# EAGLE design Ex Controller 1 USB Device (EAGLE 7.6.0)
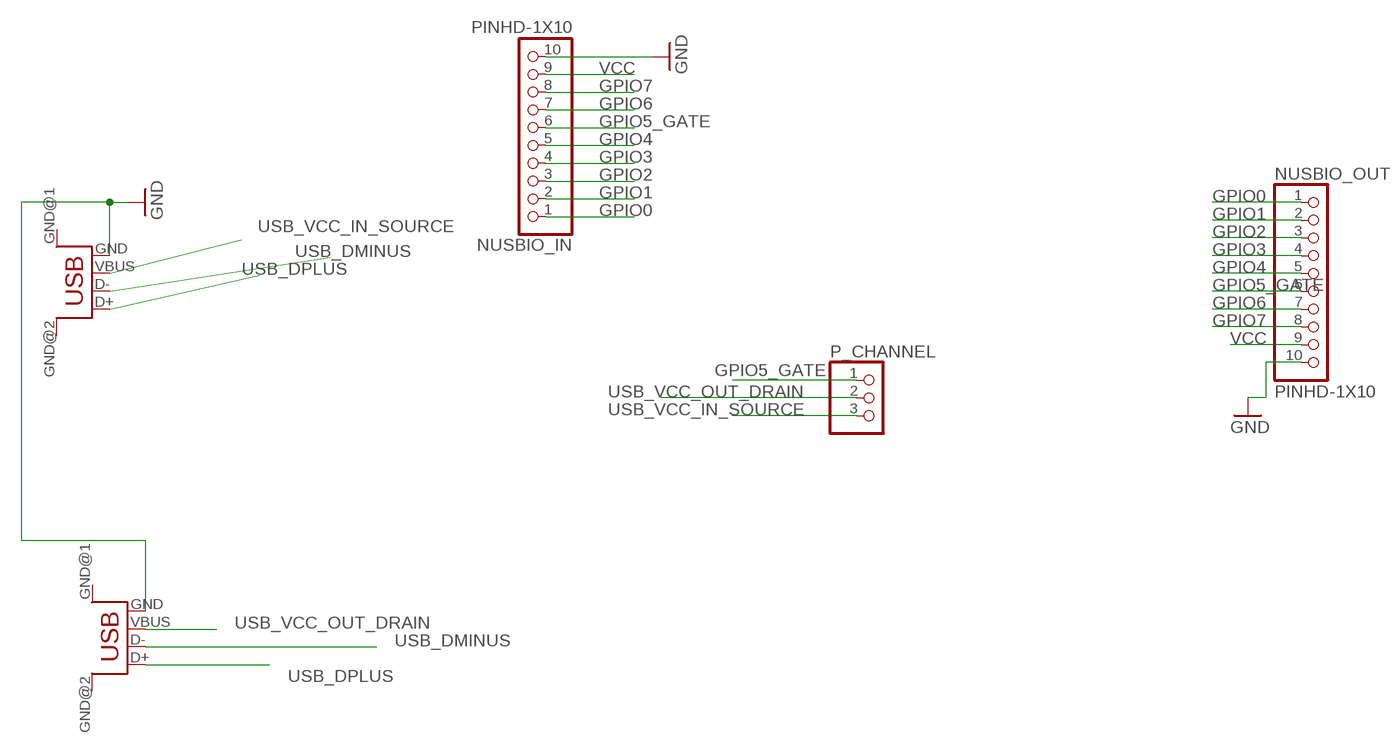
[diagram p0: schematic, sheet 1]

## Parts
NUSBIO_IN  PINHD-1X10  [1X10-BIG]
NUSBIO_OUT  PINHD-1X10  [1X10-BIG]
P_CHANNEL  PINHD-1X3  [1X03]
USB_DEV_INPUT  USB  [USB-FEMALE-A-PTH]
USB_DEV_OUTPUT  USB  [USB-FEMALE-A-PTH]

## Nets
GND: NUSBIO_IN.10 NUSBIO_OUT.10 USB_DEV_INPUT.GND USB_DEV_OUTPUT.GND
GPIO0: NUSBIO_IN.1 NUSBIO_OUT.1
GPIO1: NUSBIO_IN.2 NUSBIO_OUT.2
GPIO2: NUSBIO_IN.3 NUSBIO_OUT.3
GPIO3: NUSBIO_IN.4 NUSBIO_OUT.4
GPIO4: NUSBIO_IN.5 NUSBIO_OUT.5
GPIO5_GATE: NUSBIO_IN.6 NUSBIO_OUT.6 P_CHANNEL.1
GPIO6: NUSBIO_IN.7 NUSBIO_OUT.7
GPIO7: NUSBIO_IN.8 NUSBIO_OUT.8
USB_DMINUS: USB_DEV_INPUT.D- USB_DEV_OUTPUT.D-
USB_DPLUS: USB_DEV_INPUT.D+ USB_DEV_OUTPUT.D+
USB_VCC_IN_SOURCE: P_CHANNEL.3 USB_DEV_INPUT.VBUS
USB_VCC_OUT_DRAIN: P_CHANNEL.2 USB_DEV_OUTPUT.VBUS
VCC: NUSBIO_IN.9 NUSBIO_OUT.9
Unconnected: USB_DEV_INPUT.GND@1(GND) USB_DEV_INPUT.GND@2(GND) USB_DEV_OUTPUT.GND@1(GND) USB_DEV_OUTPUT.GND@2(GND)

## Library data of the parts
NUSBIO_IN NUSBIO_OUT = adafruit:PINHD-1X10: Pin header 1x10 0.1" spacing With round pins
P_CHANNEL = adafruit:PINHD-1X3: PIN HEADER
USB_DEV_INPUT USB_DEV_OUTPUT = STUNTAZ:USB: USB Connectors USB-FEMALE-A-PTH: Through hole Female Type A Connector

## Board
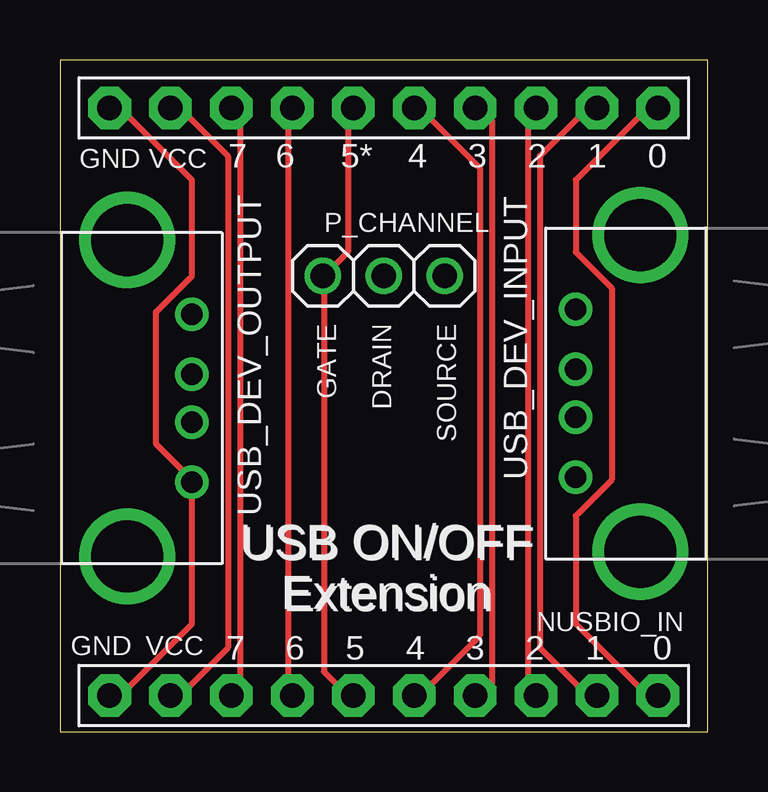
[diagram p1: board, top side]
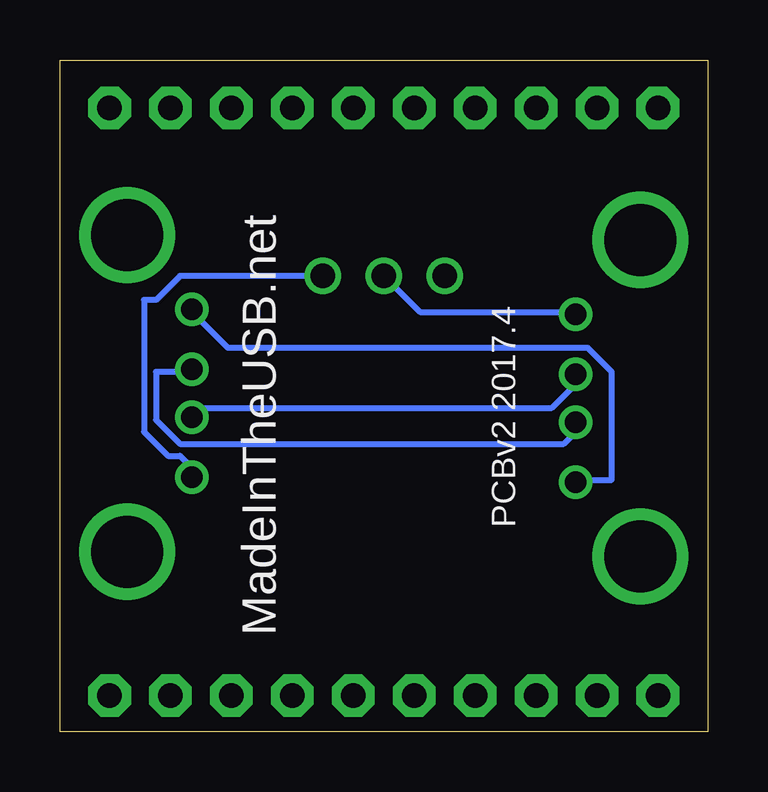
[diagram p2: board, bottom side, seen from below]

Size 27 x 28 mm. Coordinates in mm from the lower left corner, seen from the top.
Outline: 0,0 27,0 27,28 0,28 0,0
Copper layers (1*16): Top 0.035mm / dielectric 1.5mm / Bottom 0.035mm
Design rules "default": minimum track width 10mil, minimum drill 24mil, track to track 8mil, track to pad 8mil, pad to pad 8mil, via to via 8mil, smd to smd 8mil, copper to edge 40mil, drill to drill 8mil, minimum pad ring 10mil, minimum via ring 8mil, stop-mask expansion 4mil, vias tented up to drill 0mil, thermal gap 10mil

### Footprints (pad centres in the part's own frame; a part is rotated, then mirrored left to right if it is on the bottom)
1X10-BIG = drill 1.016 pad 1.778 octagon: 1 -11.43,0; 2 -8.89,0; 3 -6.35,0; 4 -3.81,0; 5 -1.27,0; 6 1.27,0; 7 3.81,0; 8 6.35,0; 9 8.89,0; 10 11.43,0
1X03 = drill 1.016: 1 -2.54,0; 2 0,0; 3 2.54,0
USB-FEMALE-A-PTH = drill 0.9: D+ 5.9,1.3; D- 7.9,1.3; GND 3.4,1.3; VBUS 10.4,1.3 | drill 3: GND@1 13.5,4; GND@2 0.3,4

### Placement (x,y rotation side)
NUSBIO_IN  13.5,1.5 180 top
NUSBIO_OUT  13.5,26 180 top
P_CHANNEL  13.5,19 0 top
USB_DEV_INPUT  20.2,21 270 top
USB_DEV_OUTPUT  6.8,7 90 top

### Tracks (layer width: path | path; a pad name or v marks a point on that pad's centre or on a via)
GND
  Top 0.254: NUSBIO_IN.10 2.5,1.5 5.5,4.5 USB_DEV_OUTPUT.GND 5.5,10.5 4,12 4,17.5 5.5,19 5.5,23 2.5,26 NUSBIO_OUT.10
  Bottom 0.254: USB_DEV_INPUT.GND 21.5,17.5 20,16 5,16 4,15 4,10.5 5.5,10.5 USB_DEV_OUTPUT.GND
GPIO0
  Top 0.254: NUSBIO_IN.1 24.5,1.5 21.5,4.5 21.5,9 23,10.5 23,18.5 21.5,20 21.5,23 24.5,26 NUSBIO_OUT.1
GPIO1
  Top 0.254: NUSBIO_IN.2 22,1.5 20,3.5 20,24 22,26 NUSBIO_OUT.2
GPIO2
  Top 0.254: NUSBIO_IN.3 19.5,1.5 19.5,26 NUSBIO_OUT.3
GPIO3
  Top 0.254: NUSBIO_IN.4 17.5,1.5 18,2 18,25.5 17.5,26 NUSBIO_OUT.4
GPIO4
  Top 0.254: NUSBIO_IN.5 15,1.5 17.5,4 17.5,23.5 15,26 NUSBIO_OUT.5
GPIO5_GATE
  Top 0.254: 11,19 12,20 12,26 NUSBIO_OUT.6 | 11,19 11,2.5 12,1.5 NUSBIO_IN.6 | 11,19 P_CHANNEL.1
GPIO6
  Top 0.254: NUSBIO_IN.7 9.5,1.5 9.5,26 NUSBIO_OUT.7
GPIO7
  Top 0.254: NUSBIO_IN.8 7.5,1.5 7.5,26 NUSBIO_OUT.8
USB_DMINUS
  Bottom 0.254: USB_DEV_OUTPUT.D- 5.5,14.5 6.5,13.5 21.5,13.5 USB_DEV_INPUT.D-
USB_DPLUS
  Bottom 0.254: USB_DEV_OUTPUT.D+ 5.5,12.5 6,12 22,12 23,13 23,15 21.5,15 USB_DEV_INPUT.D+
USB_VCC_IN_SOURCE
  Bottom 0.254: P_CHANNEL.3 22,19 23,18 23.5,18 23.5,12.5 22.5,11.5 22,11.5 21.5,11 USB_DEV_INPUT.VBUS
USB_VCC_OUT_DRAIN
  Bottom 0.254: P_CHANNEL.2 12,17.5 5.5,17.5 USB_DEV_OUTPUT.VBUS
VCC
  Top 0.254: NUSBIO_IN.9 5,1.5 7,3.5 7,24 5,26 NUSBIO_OUT.9

### Text on the board
tNames: GND | VCC | 7 | 6 | 5* | 4 | 3 | 2 | 1 | 0 | GATE | DRAIN | SOURCE | USB ON/OFF / Extension | USB ON/OFF / Extension | GND | VCC | 7 | 6 | 5 | 4 | 3 | 2 | 1 | 0
bNames: PCBv2 2017.4 | MadeInTheUSB.net